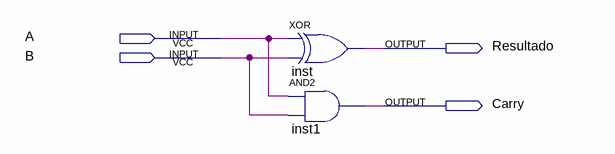
[diagram p0: schematic sheet]
// Quartus schematic HalfAdder.bdf as structural Verilog: 2 symbols, 4 pins
module HalfAdder (
  input  A,
  input  B,
  output Resultado,
  output Carry
);

  xor inst (Resultado, A, B);
  and inst1 (Carry, A, B);
endmodule
